# Altium schematic sheet 43.SchDoc
size 513 x 386 mm
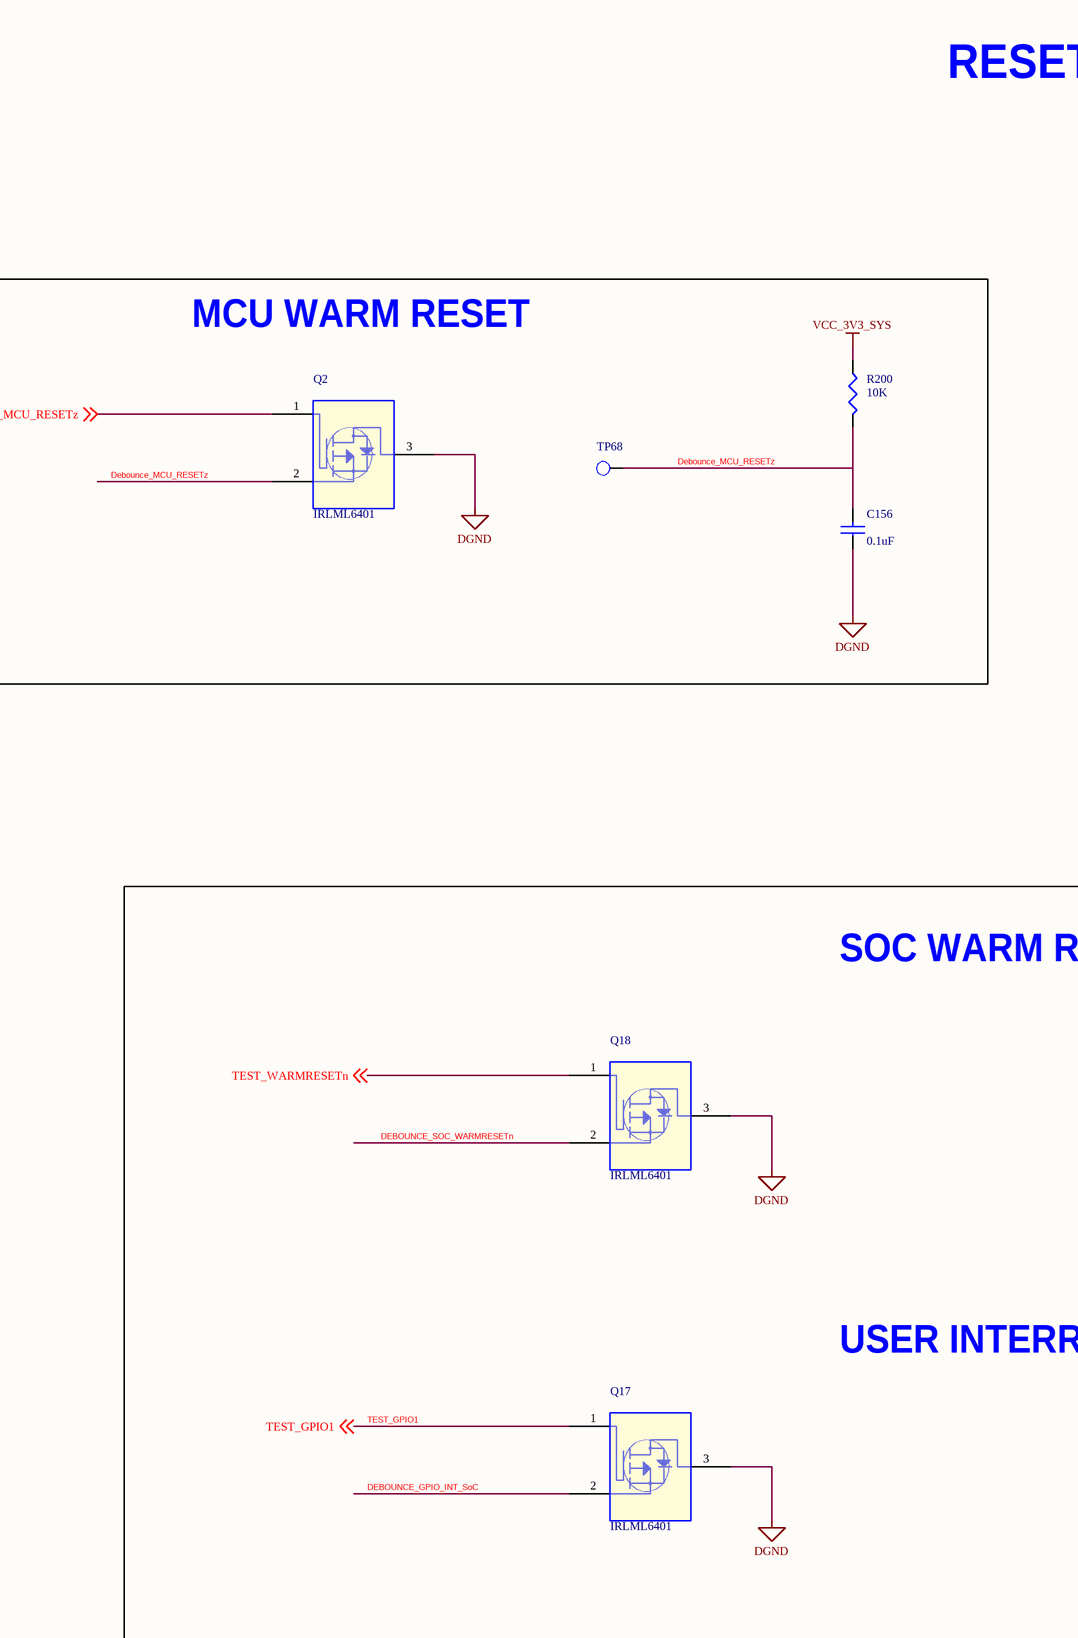
[diagram p0: 43.SchDoc, left]
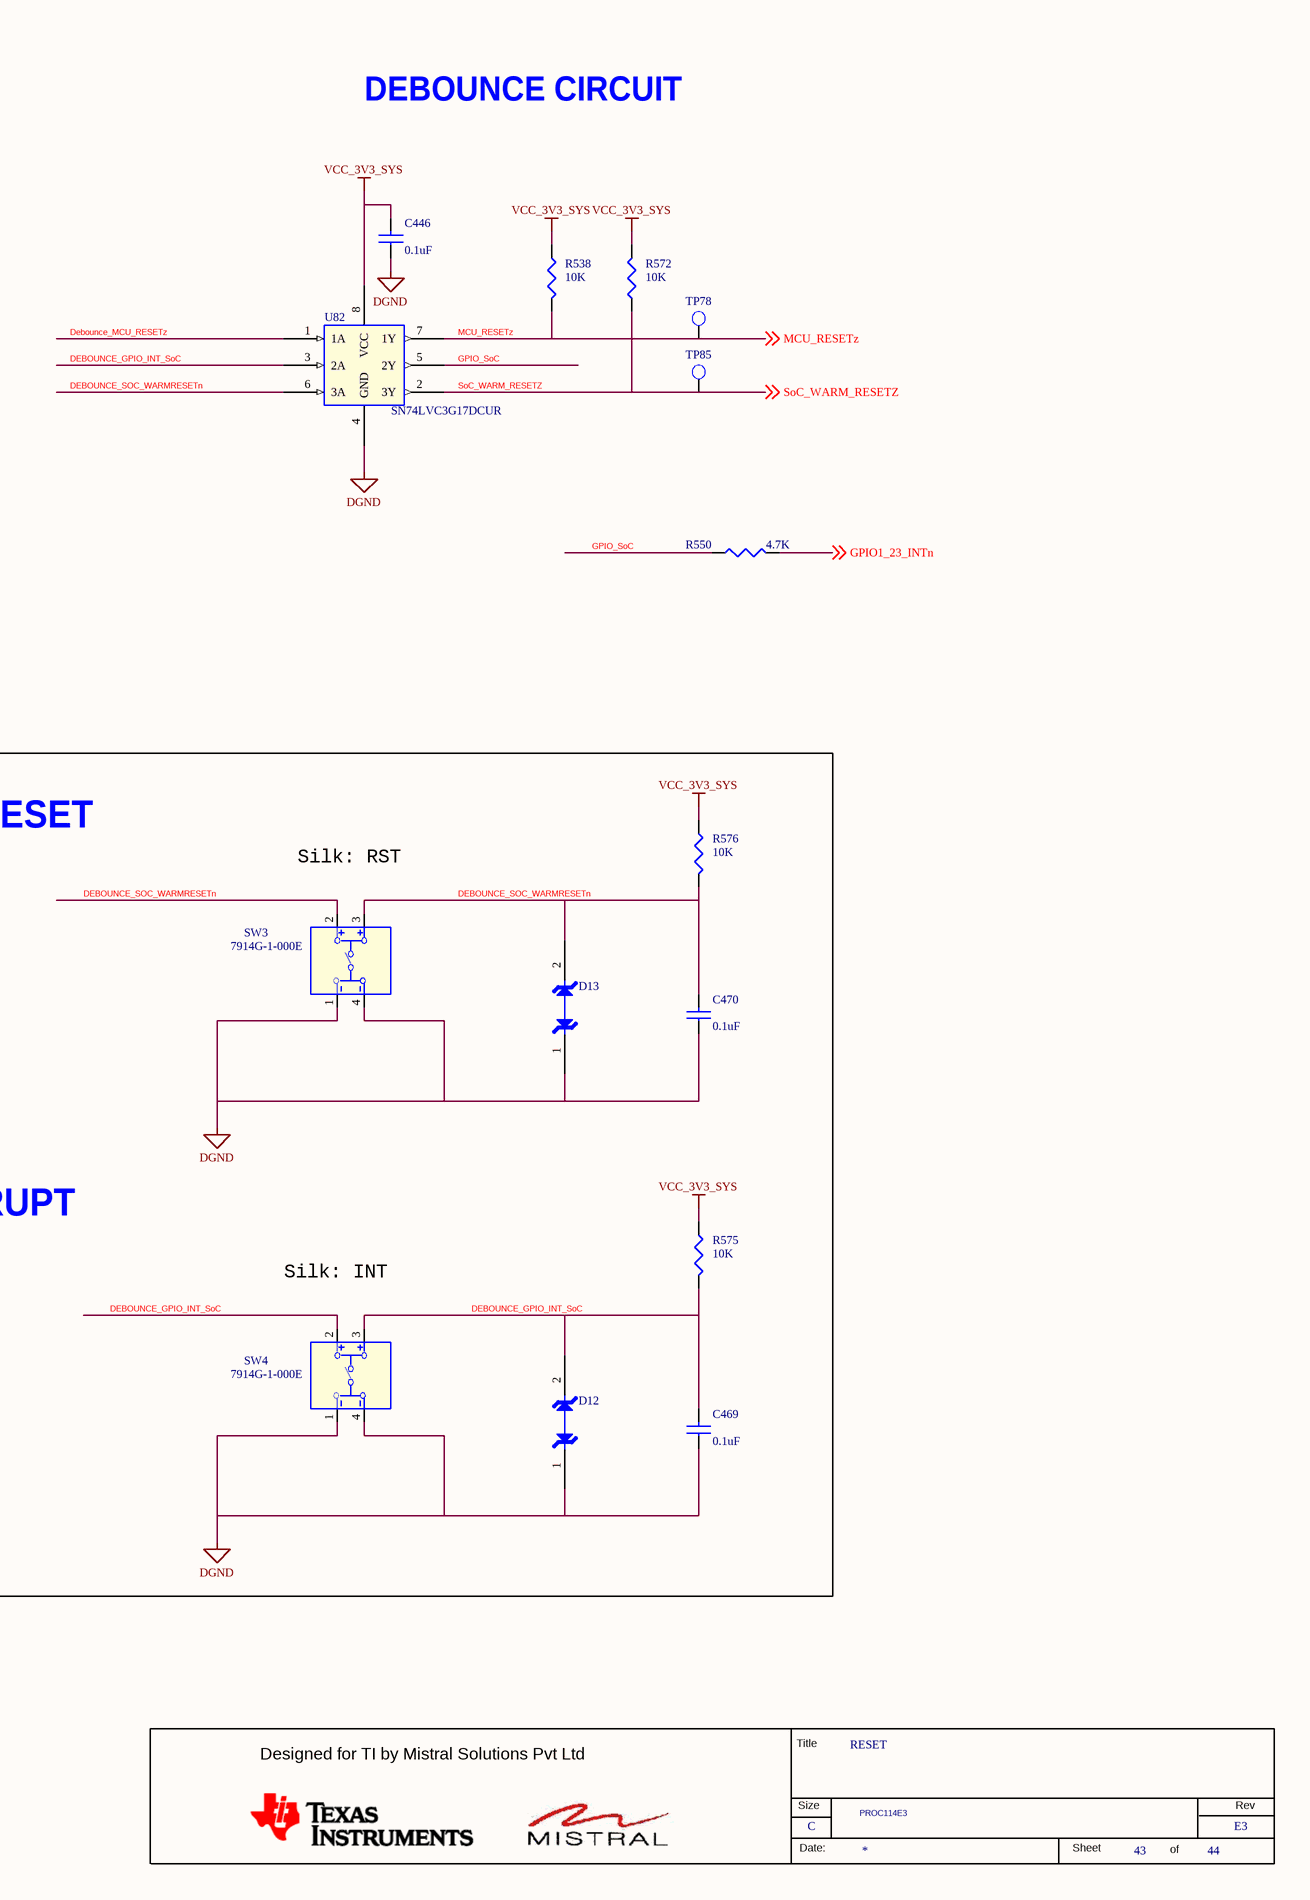
[diagram p1: 43.SchDoc, right]

## Parts
*  RevCode: E3  Title: RESET  Page Size: C  Page Number: 43  Page Count: 44  Variant Name: PROC114E3  (hidden comment: MISTRAL_TITLEBLK_CSIZE)  (graphical)
C156  0.1uF  [CAP0201_0-5]
C446  0.1uF  [CAP0201_0-5]
C469  0.1uF  [CAP0201_0-5]
C470  0.1uF  [CAP0201_0-5]
D12  TPD1E10B06DPYR  [DIO_DFN0402_0-5]  (value not drawn)
D13  TPD1E10B06DPYR  [DIO_DFN0402_0-5]  (value not drawn)
Q2  IRLML6401  [TO_SOT23-123]
Q17  IRLML6401  [TO_SOT23-123]
Q18  IRLML6401  [TO_SOT23-123]
R200  10K  [RES0201_0-5]
R538  10K  [RES0201_0-5]
R550  4.7K  [RES0201_0-5]
R572  10K  [RES0201_0-5]
R575  10K  [RES0201_0-5]
R576  10K  [RES0201_0-5]
SW3  7914G-1-000E  [SW4_100X216_200X200_SMD_4-2]
SW4  7914G-1-000E  [SW4_100X216_200X200_SMD_4-2]
TP68  TP20_SMD  [TP20_SMD]  (value not drawn)
TP78  TP20_SMD  [TP20_SMD]  (value not drawn)
TP85  TP20_SMD  [TP20_SMD]  (value not drawn)
U82  SN74LVC3G17DCUR  [VSSOP8_19-68_85X95_0-9]

## Blocks framed on the sheet
MCU WARM RESET: C156 Q2 R200 TP68

## Nets
DGND: C156.1 C446.1 C469.1 C470.1 D12.1 D13.1 Q2.3(D) Q17.3(D) Q18.3(D) SW3.1 SW3.4 SW4.1 SW4.4 U82.4(GND)
VCC_3V3_SYS: C446.2 R200.1 R538.1 R572.2 R575.1 R576.1 U82.8(VCC)
CONN_MCU_RESETz: Q2.1(G) ; off-sheet CONN_MCU_RESETz
DEBOUNCE_GPIO_INT_SoC: C469.2 D12.2 Q17.2(S) R575.2 SW4.2 SW4.3 U82.3(2A)
Debounce_MCU_RESETz: C156.2 Q2.2(S) R200.2 TP68.1(TP) U82.1(1A)
DEBOUNCE_SOC_WARMRESETn: C470.2 D13.2 Q18.2(S) R576.2 SW3.2 SW3.3 U82.6(3A)
GPIO1_23_INTn: R550.2 ; off-sheet GPIO1_23_INTn
GPIO_SoC: R550.1 U82.5(2Y)
MCU_RESETz: R538.2 TP78.1(TP) U82.7(1Y) ; off-sheet MCU_RESETz
SoC_WARM_RESETZ: R572.1 TP85.1(TP) U82.2(3Y) ; off-sheet SoC_WARM_RESETZ
TEST_GPIO1: Q17.1(G) ; off-sheet TEST_GPIO1
TEST_WARMRESETn: Q18.1(G) ; off-sheet TEST_WARMRESETn

## Notes on the sheet
- RESET
- DEBOUNCE CIRCUIT
- SOC WARM RESET
- Silk: RST
- USER INTERRUPT
- Silk: INT
- (in symbol MISTRAL_TITLEBLK_CSIZE) Title; Designed for TI by Mistral Solutions Pvt Ltd; Size; Rev; Date:; Sheet; of

## Library data of the parts
* = MISTRAL_TITLEBLK_CSIZE: Issue: 1.0; Page Create Date: March  8, 1995; Page Modify Date: *; Schematic Page Count: 44; Schematic Page Number: 43
C156 C470 = CAP_Dup2: CAP CERAMIC 0.1uF 16V 10% X5R 0201; Alt_Mfr_part_number: CC0402KRX5R8BB104; Mistral Part No: 120009030072-R; Mfr_name: MURATA; Mfr_part_number: GRM033R61C104KE14D; Part_type: CAPACITORS\CERAMIC; Alt_Mfr_name: YAGEO AMERICA; Project: TI_MAXIE_CPB; Wattage: NA; Customs_HS_Code: 85322990; Custom_Duty: 15%; Tolerance: 10%; Voltage: 16V; Package: 0201; Distributor_name: DIGIKEY; Distributor_part_number: 490-14305-1-ND; Height: 0.33MM; Weight: 0.33mg; Temperature: -55°C+85°C; Datasheet: Y:\MIS_DATABASE\DATASHEETS\CAPACITORS\GRM033R61C104KE14.PDF; Crtd /date: MANIRAJA/230118; Chkd/date: MANIRAJA/230118; MECHANICAL 3D STEP FILE: CAP0201_0-5; Library Ref: CAP; Footprint Ref: CAP0201_0-5; Library Path: Y:\MIS_DATABASE\Library\ALTIUM_TOOL\SCHEMATICS_PARTS\MS_DISCRETE_Library.schlib; Footprint Path: Y:\MIS_DATABASE\Library\ALTIUM_TOOL\PCB_FOOTPRINTS\Altium_Footprint_Lib.PcbLib; PCB Footprint: CAP0201_0-5
C446 C469 = CAP_Dup2: CAP CERAMIC 0.1uF 16V 10% X5R 0201; Alt_Mfr_name: YAGEO AMERICA; Part_type: CAPACITORS\CERAMIC; Mfr_part_number: GRM033R61C104KE14D; Mfr_name: MURATA; Mistral Part No: 120009030072-R; Alt_Mfr_part_number: CC0402KRX5R8BB104; Custom_Duty: 15%; Customs_HS_Code: 85322990; Wattage: NA; Project: TI_MAXIE_CPB; Footprint Path: Y:\MIS_DATABASE\Library\ALTIUM_TOOL\PCB_FOOTPRINTS\Altium_Footprint_Lib.PcbLib; Library Path: Y:\MIS_DATABASE\Library\ALTIUM_TOOL\SCHEMATICS_PARTS\MS_DISCRETE_Library.schlib; Footprint Ref: CAP0201_0-5; Library Ref: CAP; MECHANICAL 3D STEP FILE: CAP0201_0-5; Chkd/date: MANIRAJA/230118; Crtd /date: MANIRAJA/230118; Datasheet: Y:\MIS_DATABASE\DATASHEETS\CAPACITORS\GRM033R61C104KE14.PDF; Temperature: -55°C+85°C; Weight: 0.33mg; Height: 0.33MM; Distributor_part_number: 490-14305-1-ND; Distributor_name: DIGIKEY; Package: 0201; Voltage: 16V; Tolerance: 10%; PCB Footprint: CAP0201_0-5
D12 D13 = DIODE_SOD323: DIODE 1CH ESD PROTECTION X1SON2; Mistral Part No: 130014110022-R; Mfr_name: TEXAS INSTRUMENTS; Project: GALILEO_EVM; Tolerance: NA; Customs_HS_Code: 85423100; Custom_Duty: 15%; PCB Footprint: DIO_DFN0402_0-5; Footprint Ref: DIO_DFN0402_0-5; Mfr_part_number: TPD1E10B06DPYR; Part_type: DIODE; Voltage: NA; Wattage: NA; Package: X1SON2; Distributor_name: DIGIKEY; Distributor_part_number: 296-30406-1-ND; Library Ref: DIODE_SOD323; Height: 0.45MM; Weight: 1mg; Temperature: -40°C+125°C; Datasheet: Y:\MIS_DATABASE\DATASHEETS\ICS\INTERFACE\TPD1E10B06-SER.PDF; Crtd /date: VASANTHA/181114; Chkd/date: MANIRAJA/040420; MECHANICAL 3D STEP FILE: DIO_DFN0402_0-5; Library Path: Y:\MIS_DATABASE\Library\ALTIUM_TOOL\SCHEMATICS_PARTS\MS_DISCRETE_Library.schlib; Footprint Path: Y:\MIS_DATABASE\Library\ALTIUM_TOOL\PCB_FOOTPRINTS\Altium_Footprint_Lib.PcbLib
Q2 Q18 = MOSFET_IRLML6401TR: TRANSISTOR MOSFET P-CHANNEL SOT23-3; Mistral Part No: 130009031213-P; Mfr_name: IRF; Mfr_part_number: IRLML6401TRPBF; Part_type: TRANSISTOR\MOSFET; Project: G4_SVGA; Tolerance: NA; Customs_HS_Code: 85412900; Custom_Duty: 15%; Voltage: NA; Wattage: NA; Package: SOT23-3; Distributor_name: DIGIKEY; Distributor_part_number: IRLML6401PBFCT-ND; Height: 1.11MM; Weight: NA; Temperature: -55°C+150°C; Datasheet: Y:\MIS_DATABASE\DATASHEETS\DISCRETES\TRANSISTORS_FETS\IRLML6401.PDF; Crtd /date: MAZHAR/040505; Chkd/date: SHREESHAIL/020206; RoHS: Pb-Free; Library Ref: MOSFET_IRLML6401TR; PCB Footprint: TO_SOT23-123
Q17 = MOSFET_IRLML6401TR: TRANSISTOR MOSFET P-CHANNEL SOT23-3; Part_type: TRANSISTOR\MOSFET; Mfr_part_number: IRLML6401TRPBF; Mfr_name: IRF; Mistral Part No: 130009031213-P; Custom_Duty: 15%; Customs_HS_Code: 85412900; Wattage: NA; Project: G4_SVGA; Library Ref: MOSFET_IRLML6401TR; RoHS: Pb-Free; Chkd/date: SHREESHAIL/020206; Crtd /date: MAZHAR/040505; Datasheet: Y:\MIS_DATABASE\DATASHEETS\DISCRETES\TRANSISTORS_FETS\IRLML6401.PDF; Temperature: -55°C+150°C; Weight: NA; Height: 1.11MM; Distributor_part_number: IRLML6401PBFCT-ND; Distributor_name: DIGIKEY; Package: SOT23-3; Voltage: NA; Tolerance: NA; PCB Footprint: TO_SOT23-123
R200 R538 R575 = RESISTOR_Dup6: RES 10K 1/20W 5% 0201; Part_type: RESISTORS\FIXED; Mfr_part_number: RC0201JR-0710KL; Mfr_name: YAGEO AMERICA; Mistral Part No: 110010070051-R; Custom_Duty: 15%; Customs_HS_Code: 85332119; Voltage: NA; Project: GOLDEN-I LITE; Footprint Path: Y:\MIS_DATABASE\Library\ALTIUM_TOOL\PCB_FOOTPRINTS\Altium_Footprint_Lib.PcbLib; Library Path: Y:\MIS_DATABASE\Library\ALTIUM_TOOL\SCHEMATICS_PARTS\MS_DISCRETE_Library.schlib; MECHANICAL 3D STEP FILE: RES0201_0-5; Chkd/date: MANIRAJA/050517; Crtd /date: MANIRAJA/050517; Datasheet: Y:\MIS_DATABASE\DATASHEETS\RESISTORS\RCXXXXL-SER_MAR18.PDF; Temperature: -55°C+125°C; Weight: 0.17mg; Height: 0.26MM; Library Ref: RESISTOR; Distributor_part_number: 311-10KNCT-ND; Distributor_name: DIGIKEY; Package: 0201; Wattage: 1/20W; Tolerance: 5%; Footprint Ref: RES0201_0-5; PCB Footprint: RES0201_0-5
R550 = RESISTOR_Dup4: RES 4.7K 1/20W 5% 0201; Mistral Part No: 110021090007-R; Mfr_name: YAGEO AMERICA; Mfr_part_number: RC0201JR-074K7L; Part_type: RESISTORS\FIXED; Project: TI_AM62x SKEVM_BRD; Voltage: NA; Customs_HS_Code: 85332119; Custom_Duty: 15%; PCB Footprint: RES0201_0-5; MECHANICAL 3D STEP FILE: RES0201_0-5; Tolerance: 5%; Wattage: 1/20W; Package: 0201; Distributor_name: DIGIKEY; Distributor_part_number: 311-4.7KNCT-ND; Height: 0.26MM; Weight: 0.17mg; Temperature: -55°C+125°C; Datasheet: Y:\MIS_DATABASE\DATASHEETS\RESISTORS\RCXXXXL-SER_MAR18.PDF; Crtd /date: ALVY/200921; Chkd/date: MANIRAJA/200921; Library Ref: RESISTOR; Footprint Ref: RES0201_0-5; Library Path: Y:\MIS_DATABASE\Library\ALTIUM_TOOL\SCHEMATICS_PARTS\MS_DISCRETE_Library.schlib; Footprint Path: Y:\MIS_DATABASE\Library\ALTIUM_TOOL\PCB_FOOTPRINTS\Altium_Footprint_Lib.PcbLib; Manufacturer: YAGEO AMERICA
R572 R576 = RESISTOR_Dup6: RES 10K 1/20W 5% 0201; Mistral Part No: 110010070051-R; Mfr_name: YAGEO AMERICA; Mfr_part_number: RC0201JR-0710KL; Part_type: RESISTORS\FIXED; Project: GOLDEN-I LITE; Voltage: NA; Customs_HS_Code: 85332119; Custom_Duty: 15%; Tolerance: 5%; Wattage: 1/20W; Package: 0201; Distributor_name: DIGIKEY; Distributor_part_number: 311-10KNCT-ND; Height: 0.26MM; Weight: 0.17mg; Temperature: -55°C+125°C; Datasheet: Y:\MIS_DATABASE\DATASHEETS\RESISTORS\RCXXXXL-SER_MAR18.PDF; Crtd /date: MANIRAJA/050517; Chkd/date: MANIRAJA/050517; MECHANICAL 3D STEP FILE: RES0201_0-5; Library Ref: RESISTOR; Footprint Ref: RES0201_0-5; Library Path: Y:\MIS_DATABASE\Library\ALTIUM_TOOL\SCHEMATICS_PARTS\MS_DISCRETE_Library.schlib; Footprint Path: Y:\MIS_DATABASE\Library\ALTIUM_TOOL\PCB_FOOTPRINTS\Altium_Footprint_Lib.PcbLib; PCB Footprint: RES0201_0-5
SW3 = 7914G-1-000E _7914G: SWITCH SPST-NO 4MM SQ SMD 7914G; Mistral Part No: 130015110004-R; Mfr_name: BOURNS; Part_type: ELECTRO-MECHANICAL\SWITCH; Project: AAAUC; Tolerance: NA; Customs_HS_Code: 85369090; Custom_Duty: 24%; PCB Footprint: SW4_100X216_200X200_SMD_4-2; Mfr_part_number: 7914G-1-000E; Voltage: NA; Wattage: NA; Package: 7914G; Distributor_name: DIGIKEY; Distributor_part_number: 7914G-000ECT-ND; Library Ref: 7914G-1-000E _7914G; Height: 4.19MM; Weight: NA; Temperature: -55°C+125°C; Datasheet: Y:\MIS_DATABASE\DATASHEETS\ICS\DIGITAL\COMBINATIONAL\7914G-1-000E.PDF; Crtd /date: BAVISH/051010; Chkd/date: VASANTHA/271216; MECHANICAL 3D STEP FILE: SW4_100X216_200X200_SMD_4-2
SW4 = 7914G-1-000E _7914G: SWITCH SPST-NO 4MM SQ SMD 7914G; Part_type: ELECTRO-MECHANICAL\SWITCH; Mfr_name: BOURNS; Mistral Part No: 130015110004-R; Custom_Duty: 24%; Customs_HS_Code: 85369090; Wattage: NA; Project: AAAUC; PCB Footprint: SW4_100X216_200X200_SMD_4-2; MECHANICAL 3D STEP FILE: SW4_100X216_200X200_SMD_4-2; Chkd/date: VASANTHA/271216; Crtd /date: BAVISH/051010; Datasheet: Y:\MIS_DATABASE\DATASHEETS\ICS\DIGITAL\COMBINATIONAL\7914G-1-000E.PDF; Temperature: -55°C+125°C; Weight: NA; Height: 4.19MM; Library Ref: 7914G-1-000E _7914G; Distributor_part_number: 7914G-000ECT-ND; Distributor_name: DIGIKEY; Package: 7914G; Voltage: NA; Tolerance: NA; Mfr_part_number: 7914G-1-000E
TP68 TP78 TP85 = TESTPOINT: TESTPOINT CIR 20 SMD; Mistral Part No: NA; Mfr_name: LOCAL; Project: BT MODULE_CSRBC04; RoHS: NA; Mfr_part_number: TP20_SMD; Part_type: TESTPOINT; Package: SMD; Distributor_name: NA; Distributor_part_number: NA; Height: NA; Crtd /date: MAZHAR/171006; Chkd/date: SHREESHAIL/171006; Tolerance: NA; Voltage: NA; Wattage: NA; Weight: NA; Temperature: NA; Datasheet: NA; MECHANICAL 3D STEP FILE: NA; Library Path: Y:\MIS_DATABASE\Library\ALTIUM_TOOL\SCHEMATICS_PARTS\MS_DISCRETE_Library.schlib; Footprint Path: Y:\MIS_DATABASE\Library\ALTIUM_TOOL\PCB_FOOTPRINTS\Altium_Footprint_Lib.PcbLib; Library Ref: TESTPOINT; Footprint Ref: TP20_SMD; Customs_HS_Code: NA; Custom_Duty: NA; PCB Footprint: TP20_SMD
U82 = SN74LVC3G17DCUR_VSSOP8: IC TRIPLE SCHMITT-TRIGGER BUFFER VSSOP8; Part_type: ICS\DIGITAL\COMBINATIONAL; Mfr_name: TEXAS INSTRUMENTS; Mistral Part No: 141017090019-R; Custom_Duty: 15%; Customs_HS_Code: 85423100; Wattage: NA; Project: TI_MAXIE_CPB; MECHANICAL 3D STEP FILE: VSSOP8_19-68_85X95_0-9; Chkd/date: MANIRAJA/280917; Crtd /date: MANIRAJA/280917; Datasheet: Y:\MIS_DATABASE\DATASHEETS\ICS\DIGITAL\COMBINATIONAL\SN74LVC3G17.PDF; Temperature: -40°C+125°C; Weight: 9.6mg; Height: 0.90MM; Distributor_part_number: 296-18818-1-ND; Distributor_name: DIGIKEY; Package: VSSOP8; Voltage: NA; Tolerance: NA; Mfr_part_number: SN74LVC3G17DCUR; Library Ref: SN74LVC3G17DCUR_VSSOP8; PCB Footprint: VSSOP8_19-68_85X95_0-9